# EAGLE design flowerfriend_rev4 (EAGLE 7.2.0)
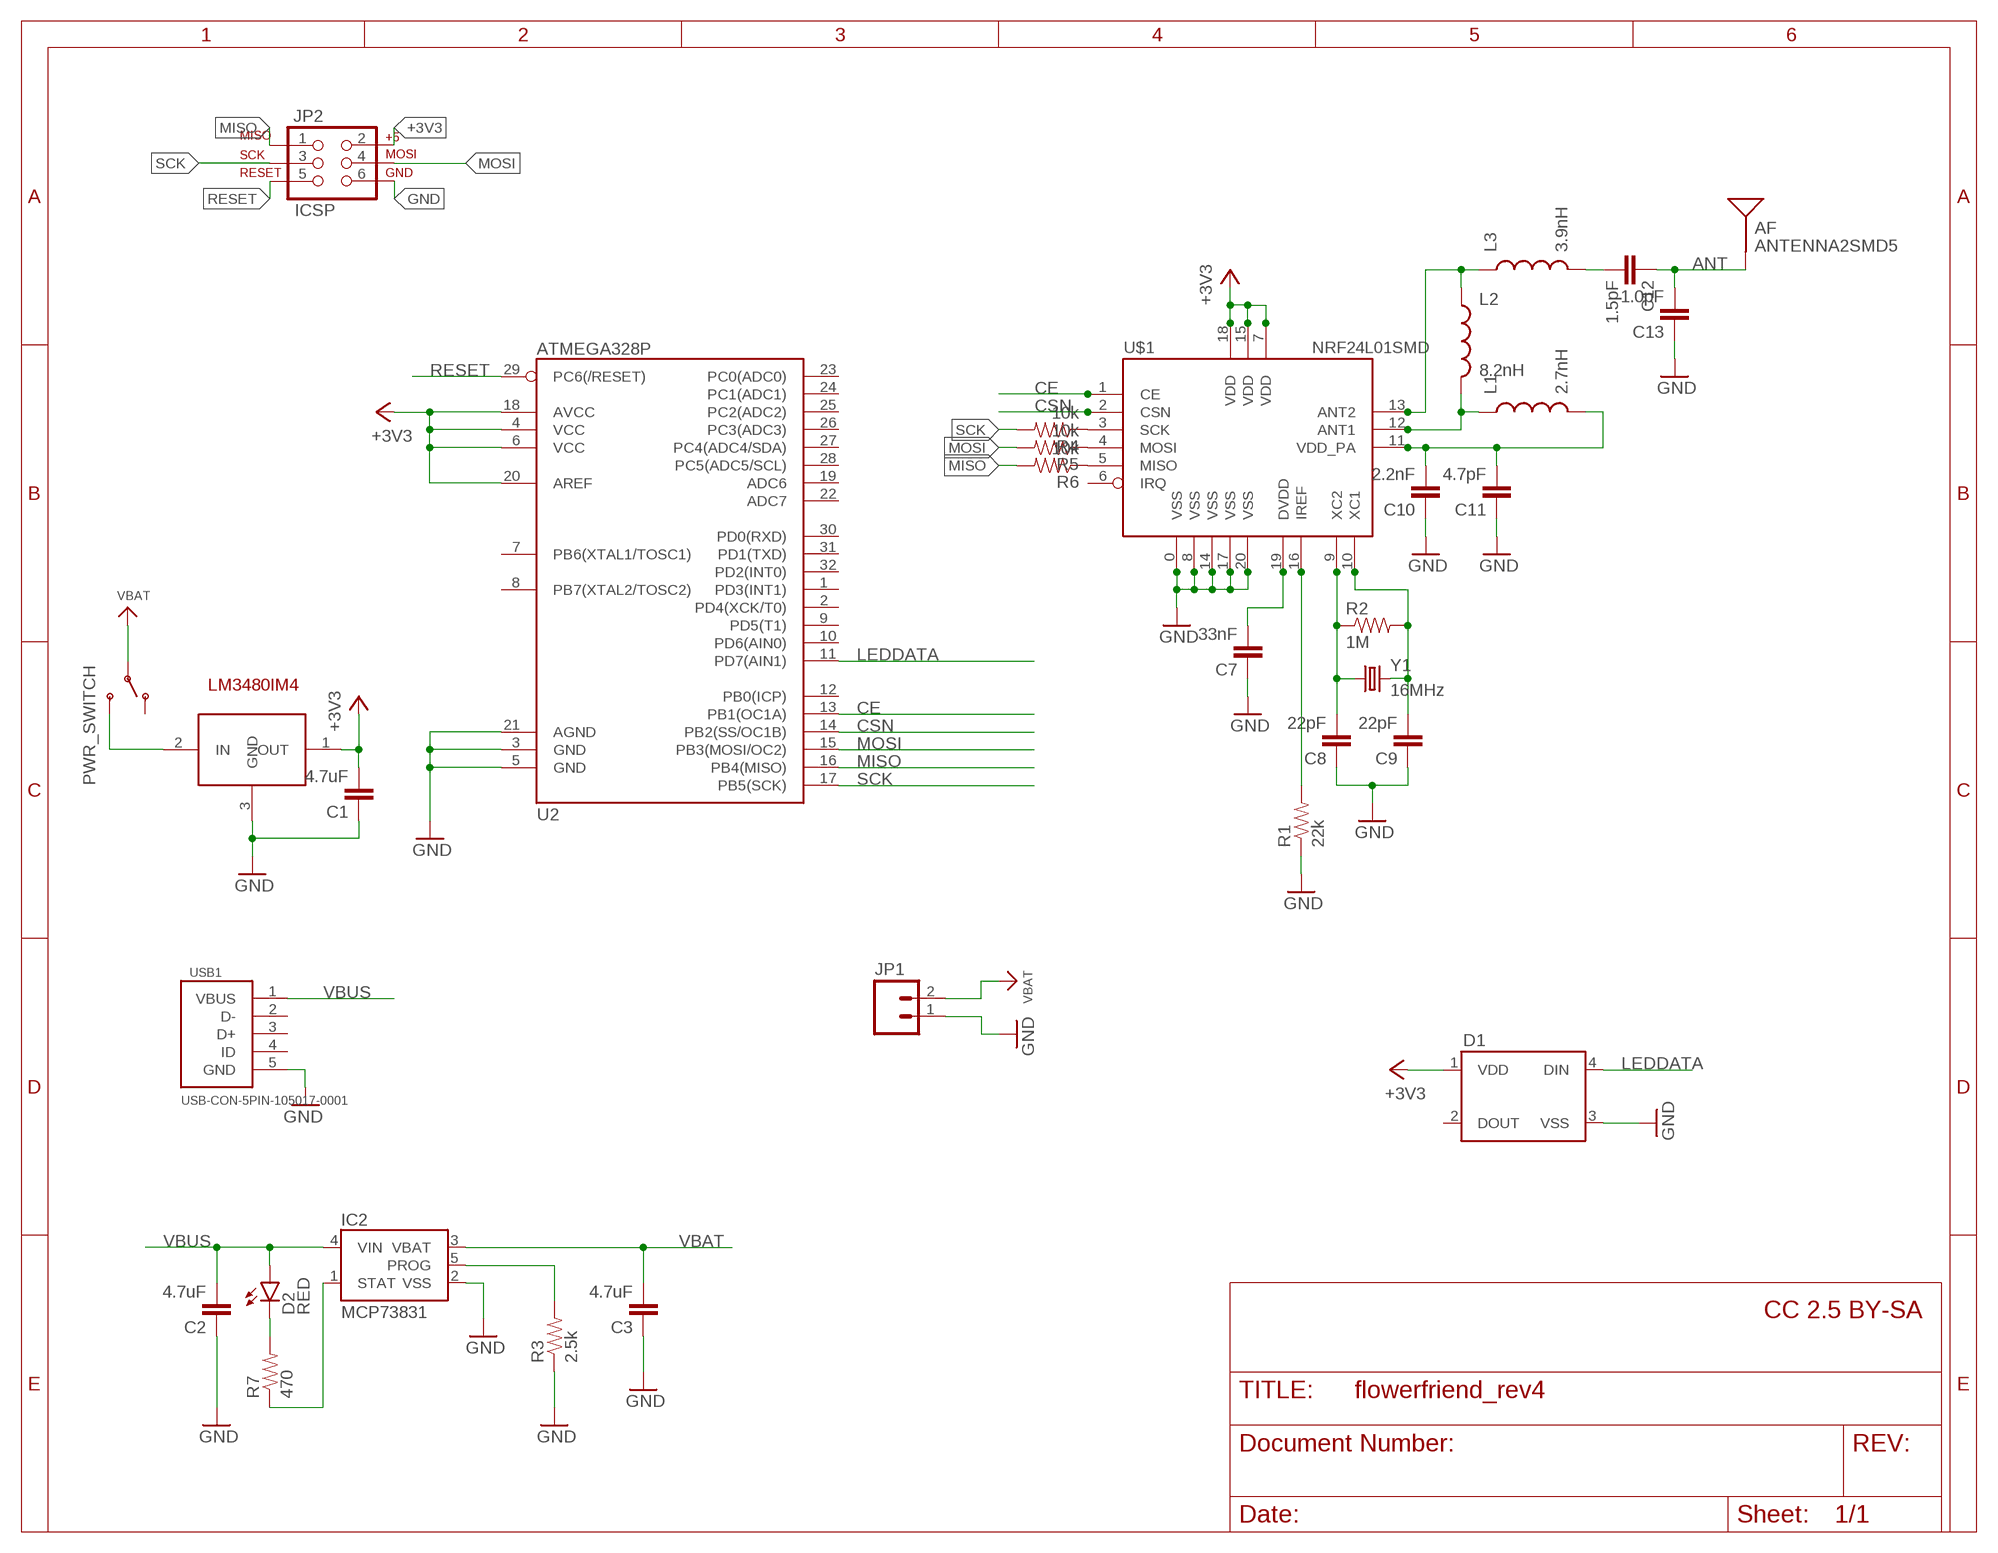
[diagram p0: schematic, sheet 1]

## Parts
AF  ANTENNA2SMD5  [ANTENNA-CHIP5]
C1  4.7uF  CAP0805  [0805]
C2  4.7uF  CAP0805  [0805]
C3  4.7uF  CAP0805  [0805]
C7  33nF  CAP0805  [0805]
C8  22pF  CAP0805  [0805]
C9  22pF  CAP0805  [0805]
C10  2.2nF  CAP0805  [0805]
C11  4.7pF  CAP0805  [0805]
C12  1.5pF  CAP0805  [0805]
C13  1.0pF  CAP0805  [0805]
D1  WS2812B  [WS2812B]
D2  RED  LED-RED0603  [LED-0603]
IC1  LM3480IM4  [SOT23-3]
IC2  MCP73831  [SOT23-5]
JP1  M02PTH  [1X02]
JP2  ICSP  AVR_SPI_PRG_6PTH  [2X3]
L1  2.7nH  INDUCTOR0805  [0805]
L2  8.2nH  INDUCTOR0805  [0805]
L3  3.9nH  INDUCTOR0805  [0805]
PWR_SWITCH  SWITCH_SPDT  [KPS-1290]
R1  22k  RESISTOR0805-RES  [0805]
R2  1M  RESISTOR0805-RES  [0805]
R3  2.5k  RESISTOR0805-RES  [0805]
R4  10k  RESISTOR0805-RES  [0805]
R5  10k  RESISTOR0805-RES  [0805]
R6  10k  RESISTOR0805-RES  [0805]
R7  470  RESISTOR0805-RES  [0805]
U2  ATMEGA328P  ATMEGA328_SMT  [TQFP32-08]
U$1  NRF24L01SMD  [QFN20]
USB1  USB-CON-5PIN-105017-0001  [USB-MICRO-MOLEX-105017-0001]
Y1  16MHz  CRYSTAL5X3  [CRYSTAL-SMD-5X3]

## Nets
+3V3 [power]: C1.2 D1.1(VDD) IC1.1(OUT) JP2.2 U2.4(VCC) U2.6(VCC) U2.18(AVCC) U2.20(AREF) U$1.7(VDD) U$1.15(VDD) U$1.18(VDD)
ANT: AF.FEED(SIGNAL) C12.1 C13.2
CE: U2.13(PB1(OC1A)) U$1.1(CE)
CSN: U2.14(PB2(SS/OC1B)) U$1.2(CSN)
GND [power]: C1.1 C2.1 C3.1 C7.1 C8.1 C9.1 C10.1 C11.1 C13.1 D1.3(VSS) IC1.3(GND) IC2.2(VSS) JP1.1 JP2.6 R1.1 R3.1 U2.3(GND) U2.5(GND) U2.21(AGND) U$1.0(VSS) U$1.8(VSS) U$1.14(VSS) U$1.17(VSS) U$1.20(VSS) USB1.5(GND)
LEDDATA: D1.4(DIN) U2.11(PD7(AIN1))
MISO: JP2.1 R6.2 U2.16(PB4(MISO))
MOSI: JP2.4 R5.2 U2.15(PB3(MOSI/OC2))
N$1: IC2.5(PROG) R3.2
N$4: C8.2 R2.1 U$1.9(XC2) Y1.1
N$5: C9.2 R2.2 U$1.10(XC1) Y1.3
N$6: R4.1 U$1.3(SCK)
N$7: R5.1 U$1.4(MOSI)
N$8: L2.1 L3.1 U$1.13(ANT2)
N$9: C10.2 C11.2 L1.2 U$1.11(VDD_PA)
N$10: R1.2 U$1.16(IREF)
N$11: C7.2 U$1.19(DVDD)
N$12: L1.1 L2.2 U$1.12(ANT1)
N$13: C12.2 L3.2
N$14: R6.1 U$1.5(MISO)
N$15 [power]: IC1.2(IN) PWR_SWITCH.S
N$16: D2.C R7.2
N$17: IC2.1(STAT) R7.1
RESET: JP2.5 U2.29(PC6(/RESET))
SCK: JP2.3 R4.2 U2.17(PB5(SCK))
VBAT [power]: C3.2 IC2.3(VBAT) JP1.2 PWR_SWITCH.P
VBUS: C2.2 D2.A IC2.4(VIN) USB1.1(VBUS)
Unconnected: D1.2(DOUT) PWR_SWITCH.O U2.1(PD3(INT1)) U2.2(PD4(XCK/T0)) U2.7(PB6(XTAL1/TOSC1)) U2.8(PB7(XTAL2/TOSC2)) U2.9(PD5(T1)) U2.10(PD6(AIN0)) U2.12(PB0(ICP)) U2.19(ADC6) U2.22(ADC7) U2.23(PC0(ADC0)) U2.24(PC1(ADC1)) U2.25(PC2(ADC2)) U2.26(PC3(ADC3)) U2.27(PC4(ADC4/SDA)) U2.28(PC5(ADC5/SCL)) U2.30(PD0(RXD)) U2.31(PD1(TXD)) U2.32(PD2(INT0)) U$1.6(IRQ) USB1.2(D-) USB1.3(D+) USB1.4(ID)

## Notes on the sheet
- CC 2.5 BY-SA

## Library data of the parts
AF = SparkFun-RF:ANTENNA2: Chip antenna Single endded antenna. Common with smaller chip antennas. CHIP4 package is the GPS Chip Antenna SKU: GPS-08418. CHIP5 package is 2.4GHz chip antenna SKU: WRL-00144.
C1-C3 C7-C13 = SparkFun-Passives:CAP: Capacitor Standard 0603 ceramic capacitor, and 0.1" leaded capacitor.
D1 = SparkFun-LED:WS2812B: WS2812B - Intelligent control LED integrated light source Technical Specifications: Power Supply Voltage (VDD): 3.5 to 5.3 V Input Voltage (VI): -0.5 to VDD+0.5 V Operating Junction Temperature (Topt): -25°C to +80°C Storage Temperature Range (Tstg): -55°C to +150°C; PROD_ID: DIO-12503
D2 = SparkFun-LED:LED-RED: Assorted Red LEDs LilyPad 1206- DIO-09912 1206- DIO-00809 0603- DIO-00819 "SMART" means more efficient and expensive; PROD_ID: DIO-00819
IC1 = SparkFun-PowerIC:LM3480IM4: Small package linear regulator
IC2 = SparkFun-PowerIC:MCP73831: Miniature single cell, fully integrated Li-Ion, Li-polymer charge management controller http://ww1.microchip.com/downloads/en/DeviceDoc/20001984g.pdf IC-09995; PROD_ID: IC-09995
JP1 = SparkFun-Connectors:M02: Standard 2-pin 0.1" header. Use with - straight break away headers ( PRT-00116) - right angle break away headers (PRT-00553) - swiss pins (PRT-00743) - machine pins (PRT-00117) - female headers (PRT-00115) Molex polarized connector foot print use with: PRT-08233 with associated crimp pins and housings. 2.54_SCREWTERM for use with PRT-10571. 3.5mm Screw Terminal footprints for PRT-08084 5mm Screw Terminal footprints for use with PRT-08432
JP2 = SparkFun-Connectors:AVR_SPI_PRG_6: AVR ISP 6 Pin This is the reduced ISP connector for AVR programming. Common on Arduino. This footprint will take up less PCB space and can be used with a 10-pin to 6-pin adapter such as SKU: BOB-08508 **Special note about "TEST_POINT" package. The stop mask is on the top side, so if you want your programming test points to be on the bottom of your board, make sure to place this package on the bottom side of the board. This also ensure that the orientation to program from the bottom side will be correct.
L1-L3 = SparkFun-Passives:INDUCTOR: Inductors Basic Inductor/Choke - 0603 and 1206. Footprints are not proven and vary greatly between part numbers. SRN6045- 33uH, 20% 1.4A SDR0403-560KL - 56uH, 10%, 500mA RMS/740mA peak
PWR_SWITCH = SparkFun-Electromechanical:SWITCH_SPDT: SWCH-10651 Side-actuated SPDT slide switch, as used on the Arduino Pro; PROD_ID: SWCH-10651
R1-R7 = SparkFun-Passives:RESISTOR: Resistor Basic schematic elements and footprints for 0603, 1206, and PTH resistors.
U2 = SparkFun-DigitalIC:ATMEGA328_SMT: 32-Pin Atmega328 part Commonly used on Arduino compatible boards Available in QFP and QFN packages TQFP is IC-09069 QFN is non-stock; PROD_ID: IC-09069
U$1 = SparkFun-RF:NRF24L01: 2.4GHz Low Power Transceiver This is the very popular, low cost, very low power RF transceiver from Nordic Semiconductor. Simple SPI interface. SKU: COM-00690
USB1 = GeekAmmo:USB-CON-5PIN: Molex Micro USB 105017-0001
Y1 = SparkFun-FreqCtrl:CRYSTAL: Various standard crystals. Proven footprints.; PROD_ID: XTAL-08218

## Net classes
1 power: width 0.305 mm

## Board
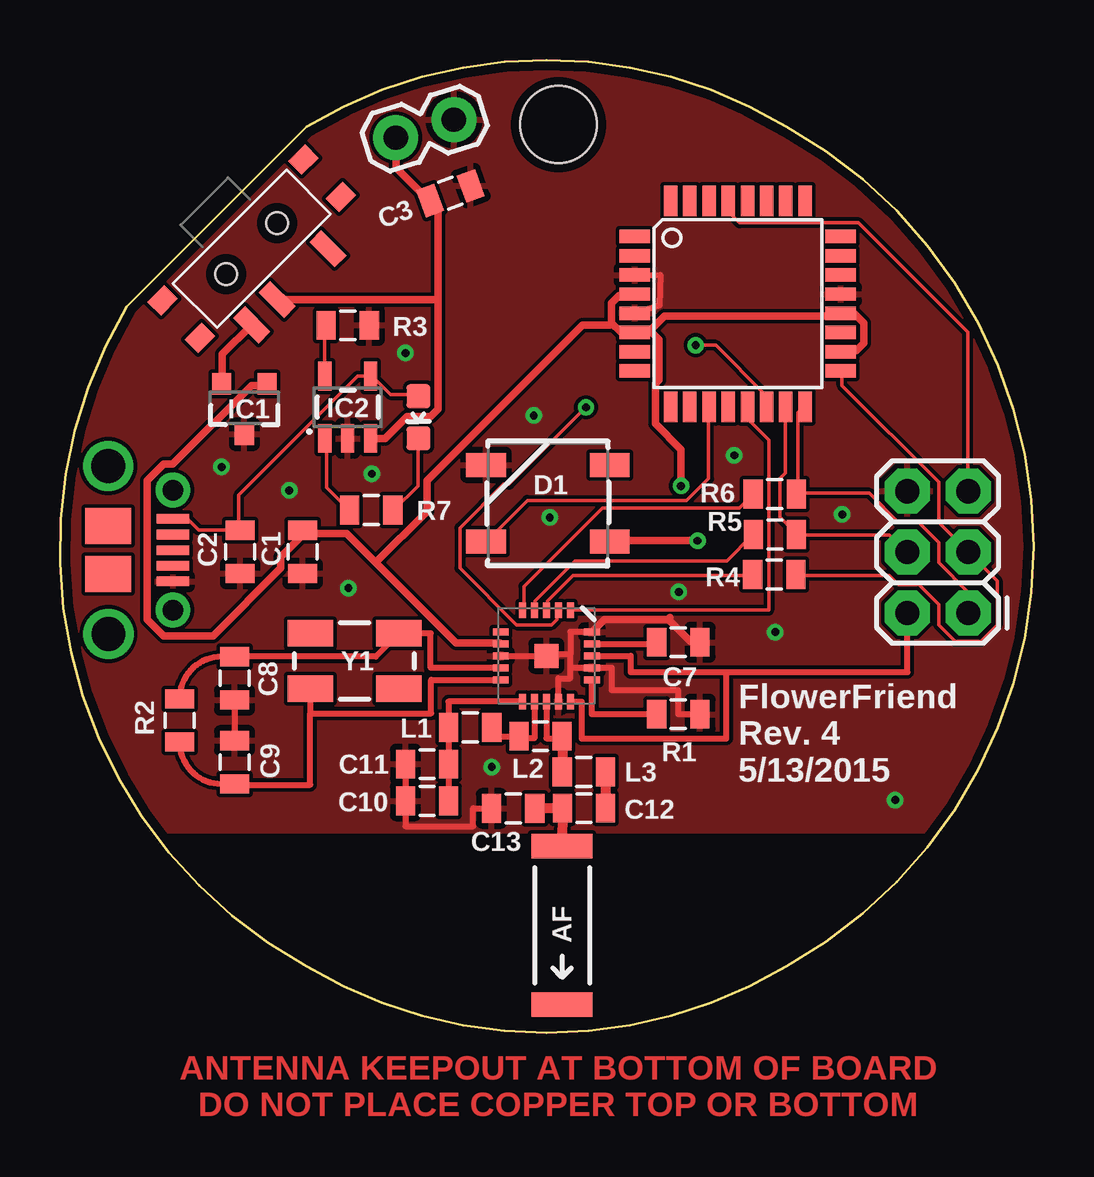
[diagram p1: board, top side]
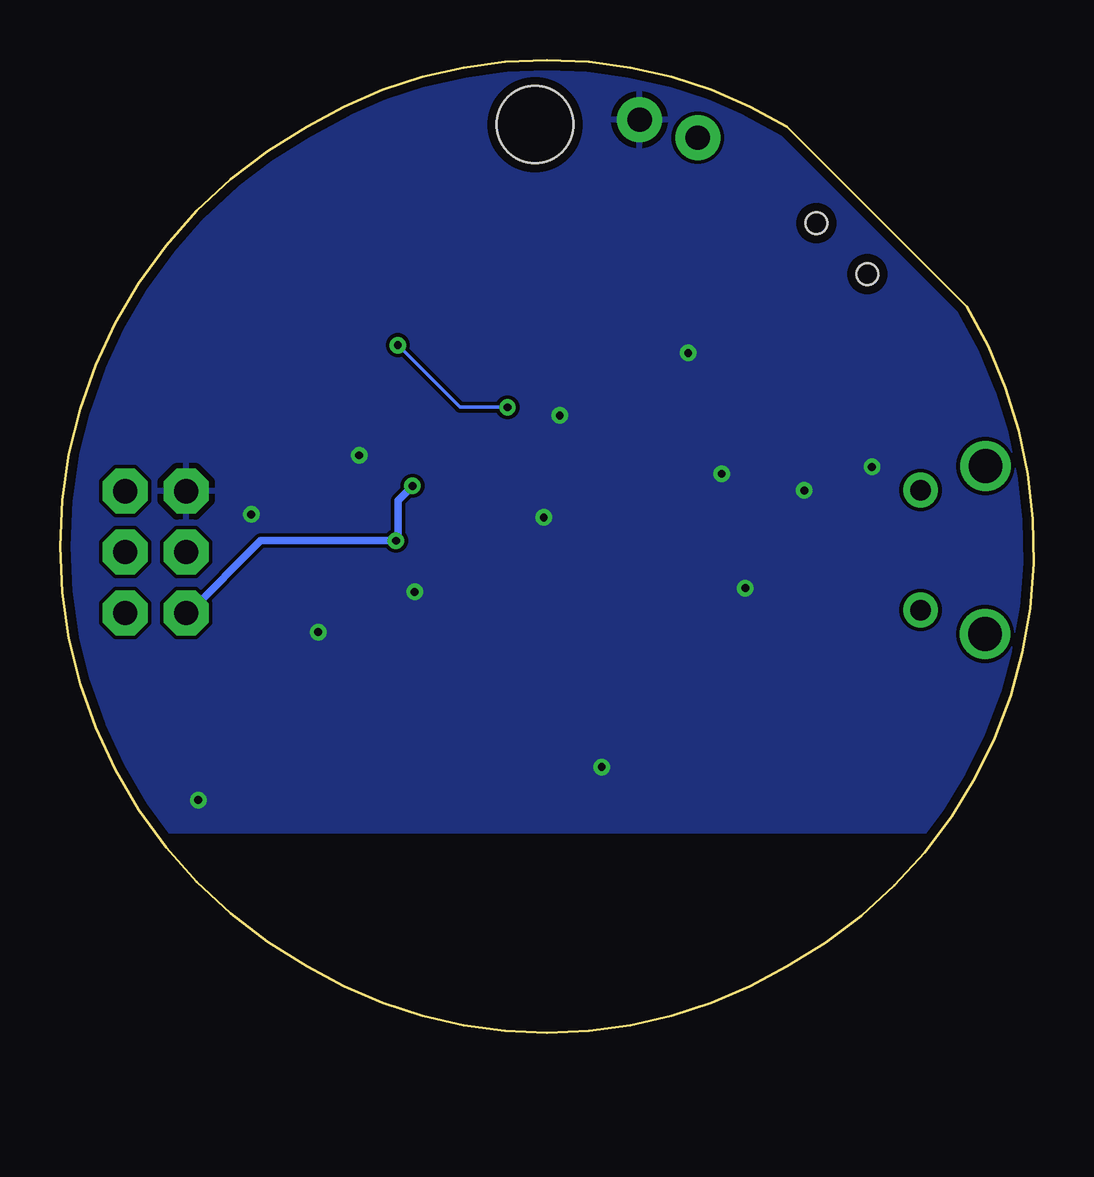
[diagram p2: board, bottom side, seen from below]

Size 40.58 x 40.55 mm. Coordinates in mm from the lower left corner, seen from the top.
Outline: 2.78,30.27 10.28,37.77 arc-62 30.28,37.77 arc-122 30.28,2.77 arc-62 10.28,2.77 arc-92 2.78,30.27
Copper layers (1*16): Top 0.0356mm / dielectric 1.5011mm / Bottom 0.0356mm
Design rules "LaenPCBOrder *": minimum track width 6mil, minimum drill 13mil, track to track 6mil, track to pad 6mil, pad to pad 6mil, via to via 6mil, smd to smd 6mil, copper to edge 15mil, drill to drill 6mil, minimum pad ring 7mil, minimum via ring 7mil, stop-mask expansion 3mil, vias tented up to drill 0mil, thermal gap 10mil
Holes 3.2 mm at 20.78,37.86
tKeepout: area -0.7,0.3 to 41.3,8.3
bKeepout: area -0.7,0.3 to 41.3,8.3

### Footprints (pad centres in the part's own frame; a part is rotated, then mirrored left to right if it is on the bottom)
ANTENNA-CHIP5 = smd 1.016 x 2.54: FEED -3.302,0; NC 3.302,0
0805 = smd 0.8 x 1.2: 1 -0.9,0; 2 0.9,0
WS2812B = smd 1.651 x 1: 1 -2.577,1.6; 2 -2.577,-1.6; 3 2.577,-1.6; 4 2.577,1.6
LED-0603 = smd 1 x 1: A 0,-0.877; C 0,0.877
SOT23-3 = smd 0.8 x 0.9: 1 -0.95,-1; 2 0.95,-1; 3 0,1.1
SOT23-5 = smd 0.55 x 1.2: 1 -0.95,-1.3; 2 0,-1.3; 3 0.95,-1.3; 4 0.95,1.3; 5 -0.95,1.3
1X02 = drill 1.016 pad 1.88: 1 0,0; 2 2.54,0
2X3 = drill 1.016 pad 1.88 octagon: 1 0,0; 2 0,2.54; 3 2.54,0; 4 2.54,2.54; 5 5.08,0; 6 5.08,2.54
KPS-1290 = smd 0.7 x 1.5: O -2.25,2.25; P 0.75,2.25; S 2.25,2.25 | smd 1 x 0.8: P$1 -4.15,1.1; P$2 -4.15,-1.1; P$3 4.15,-1.1; P$4 4.15,1.1 | hole 0.9: -1.5,0; 1.5,0
TQFP32-08 = smd 1.27 x 0.559: 1 -4.293,2.8; 2 -4.293,2; 3 -4.293,1.2; 4 -4.293,0.4; 5 -4.293,-0.4; 6 -4.293,-1.2; 7 -4.293,-2; 8 -4.293,-2.8; 17 4.293,-2.8; 18 4.293,-2; 19 4.293,-1.2; 20 4.293,-0.4; 21 4.293,0.4; 22 4.293,1.2; 23 4.293,2; 24 4.293,2.8 | smd 0.559 x 1.27: 9 -2.8,-4.293; 10 -2,-4.293; 11 -1.2,-4.293; 12 -0.4,-4.293; 13 0.4,-4.293; 14 1.2,-4.293; 15 2,-4.293; 16 2.8,-4.293; 25 2.8,4.293; 26 2,4.293; 27 1.2,4.293; 28 0.4,4.293; 29 -0.4,4.293; 30 -1.2,4.293; 31 -2,4.293; 32 -2.8,4.293
QFN20 = smd 1 x 1: 0 0,0 | smd 0.65 x 0.3: 1 -1.9,1; 2 -1.9,0.5; 3 -1.9,0; 4 -1.9,-0.5; 5 -1.9,-1; 11 1.9,-1; 12 1.9,-0.5; 13 1.9,0; 14 1.9,0.5; 15 1.9,1 | smd 0.3 x 0.65: 6 -1,-1.9; 7 -0.5,-1.9; 8 0,-1.9; 9 0.5,-1.9; 10 1,-1.9; 16 1,1.9; 17 0.5,1.9; 18 0,1.9; 19 -0.5,1.9; 20 -1,1.9
USB-MICRO-MOLEX-105017-0001 = smd 0.4 x 1.35: 1 1.2,0; 2 1.85,0; 3 2.5,0; 4 3.15,0; 5 3.8,0 | drill 0.85 pad 1.45: P$1 0,0; P$2 5,0 | smd 1.5 x 1.9: P$3 3.5,-2.7; P$4 1.5,-2.7 | drill 1.4: P$5 -1.004,-2.701; P$6 5.999,-2.69
CRYSTAL-SMD-5X3 = smd 1.9 x 1.1: 1 -1.85,-1.15; 2 1.85,-1.15; 3 1.85,1.15; 4 -1.85,1.15

### Placement (x,y rotation side)
AF  20.93,4.47 270 top
C1  10.11,20.04 90 top
C2  7.51,20.04 90 top
C3  16.28,34.99 200 top
C7  25.78,16.27 180 top
C8  7.28,14.77 90 top
C9  7.28,11.27 270 top
C10  15.3,9.66 0 top
C11  15.3,11.19 0 top
C12  21.84,9.36 0 top
C13  18.89,9.35 0 top
D1  20.34,22.07 180 top
D2  14.94,25.65 180 top
IC1  7.69,26.05 180 top
IC2  11.99,26.07 0 top
JP1  16.42,38.06 197.1 top
JP2  37.86,17.49 90 top
L1  17.1,12.72 180 top
L2  20.03,12.36 180 top
L3  21.84,10.87 0 top
PWR_SWITCH  7.99,32.68 225 top
R1  25.78,13.27 180 top
R2  4.98,13.02 270 top
R3  11.99,29.49 180 top
R4  29.77,19.09 0 top
R5  29.8,20.77 0 top
R6  29.79,22.45 0 top
R7  12.98,21.78 0 top
U2  28.26,30.39 0 top
U$1  20.28,15.7 270 top
USB1  4.71,22.62 270 top
Y1  12.28,15.49 180 top

### Tracks (layer width: path | path; a pad name or v marks a point on that pad's centre or on a via)
+3V3  (via drill 0.33)
  Top 0.254: U$1.18 23.78,15.7 23.78,15.03 27.77,15.03 | 27.77,15.03 35.32,15.03 JP2.2 | U$1.15 21.74,13.8 21.74,12.26 27.77,12.26 27.77,15.03
  Top 0.305: 18.35,16.24 U$1.7 18.19,16.24 16.52,16.24 13.16,19.59 | v26.58,20.51 22.92,20.51 D1.1 | U2.18 32.6,28.43 33.21,28.43 33.51,28.74 33.51,29.57 33.13,29.95 32.6,29.95 U2.20 32.44,29.88 25.2,29.88 24.59,29.27 | 22.99,29.57 23.38,29.19 23.91,29.19 U2.6 24.06,29.27 24.59,29.27 | 22.99,29.57 22.99,30.41 23.3,30.72 23.91,30.72 U2.4 | 13.16,19.59 11.95,20.81 10.19,20.81 10.12,20.89 C1.2 10.12,20.73 9.2,19.82 9.2,19.36 6.38,16.54 4.33,16.54 3.64,17.23 3.64,23.02 4.33,23.71 4.71,23.71 7.98,26.98 8.59,26.98 IC1.1 | 13.16,19.59 15.3,21.73 15.3,23.02 21.78,29.5 22.92,29.5 22.99,29.57 | v25.89,22.79 25.89,24.32 24.82,25.38 24.82,27.06 24.98,27.21 24.98,28.89 24.59,29.27
  Bottom 0.305: JP2.2 35.26,17.46 32.21,20.51 v26.58,20.51 26.5,20.58 26.5,22.18 v25.89,22.79
ANT
  Top 0.254: C13.2 | C12.1
  Top 0.406: C12.1 C13.2 | C12.1 AF.FEED
CE
  Top 0.152: 21.32,17.61 U$1.1 21.39,17.61 29.55,17.61 29.55,24.7 28.71,25.54 28.71,26.07 U2.13
CSN  (via drill 0.33)
  Top 0.152: U$1.2 20.71,17.53 20.71,17.23 20.48,17 19.03,17 16.67,19.36 16.67,21.04 18.5,22.87 18.73,22.87 v21.93,26.07 | v26.5,28.66 27.34,28.66 29.4,26.6 29.4,26.14 U2.14
  Bottom 0.152: v21.93,26.07 23.91,26.07 v26.5,28.66
GND  (via drill 0.33 pad 0.33)
  Top 0.254: U$1.17 21.28,15.2 | 21.28,15.2 21.28,15.77 | 21.28,15.77 20.28,15.77 U$1.0 U$1.8 | U$1.20 21.28,16.7 21.28,15.77 | U$1.14 20.78,14.77 21.28,14.77 21.28,15.2 | R1.1 25.78,13.27 25.78,14.27 23.01,14.27 23.01,15.2 U$1.17 | U$1.17 | C11.1 C10.1 | C10.1 | C10.1 14.4,8.61 17.22,8.61 17.22,9.35 C13.1 | C8.1 C9.1 | U2.3 25.02,31.59 24.99,30.31 U2.5
  Top 0.305: 25.36,17.23 26.27,16.32 26.65,16.32 C7.1 | 25.36,17.23 22.69,17.23 22.23,16.77 U$1.20 | 25.43,17.31 25.36,17.23
  other vias: 6.73,23.59 13,23.3 14.4,28.33 9.55,22.6 12.02,18.53 19.75,25.73 18,11.07 29.82,16.7 34.82,9.7 20.42,21.48 25.79,18.38 28.11,24.07 32.61,21.6
  pour Top: 41.28,8.36 -0.73,8.34 -0.72,41.27 41.28,41.27
  pour Bottom: 41.28,8.36 -0.73,8.34 -0.72,41.27 41.28,41.27
LEDDATA
  Top 0.152: U2.11 27.03,26.07 27.03,23.1 26.12,22.18 19.49,22.18 17.81,20.51 D1.4
MISO
  Top 0.152: 37.85,18.37 37.85,17.53 JP2.1 37.85,18.37 | U2.16 31,26.07 30.77,25.84 30.77,22.49 R6.2 30.84,22.49 33.74,22.49 34.96,21.27 35.8,21.27 36.63,20.43 36.63,19.59 37.85,18.37
MOSI
  Top 0.152: JP2.4 35.26,20.05 34.58,20.73 30.77,20.73 R5.2 30.69,20.81 30,21.5 30,23.1 30.23,23.33 30.23,26.07 U2.15
N$1
  Top 0.152: IC2.5 11.03,27.44 11.03,29.42 R3.2
N$4
  Top 0.254: U$1.9 | U$1.9 15.45,15.2 15.45,16.64 Y1.1 13.16,15.67 C8.2 6.74,15.67 arc90 R2.1
N$5
  Top 0.254: R2.2 arc90 6.73,10.37 C9.2 7.28,10.34 | 10.28,14.34 Y1.3 10.43,13.31 | 10.43,13.31 15.47,13.31 15.47,14.7 U$1.10 | 7.28,10.27 7.28,10.34 | 7.28,10.34 10.43,10.34 10.43,13.31
N$6
  Top 0.152: 20.33,17.61 U$1.3 20.33,17.69 20.33,17.99 21.39,19.06 28.86,19.06 R4.1
N$7
  Top 0.152: U$1.4 19.79,17.61 19.79,17.99 21.47,19.67 27.8,19.67 28.86,20.73 R5.1
N$8
  Top 0.254: U$1.13 20.28,12.27 21,12.27 L2.1
  Top 0.406: L2.1 L3.1
N$9
  Top 0.254: U$1.11 16.19,13.8 L1.2 C11.2 C10.2 | C10.2
N$10
  Top 0.254: R1.2 22.18,13.27 U$1.16
N$11
  Top 0.254: U$1.19 24.88,16.2 C7.2
N$12
  Top 0.254: U$1.12 19.78,12.27 19.13,12.27 L2.2 18,12.36 L1.1
N$13
  Top 0.254: L3.2
  Top 0.406: L3.2 C12.2
N$14
  Top 0.152: 19.34,17.61 U$1.5 19.34,17.69 19.34,18.6 22.61,21.88 28.33,21.88 28.86,22.41 R6.1
N$15
  Top 0.305: IC1.2 6.76,27.06 6.76,28.28 7.98,29.5 PWR_SWITCH.S
N$16
  Top 0.152: D2.C 14.92,24.77 14.92,22.79 13.93,21.8 R7.2
N$17
  Top 0.152: IC2.1 11.11,24.7 11.11,22.72 12.02,21.8 R7.1
RESET
  Top 0.152: U2.29 27.87,34.68 27.87,34.22 28.33,33.76 33.28,33.76 37.85,29.19 37.85,22.64 JP2.5
SCK
  Top 0.152: R4.2 30.69,19.06 34.58,19.06 34.96,18.68 35.8,18.68 36.63,17.84 36.63,17 37.32,16.32 38.39,16.32 39.07,17 39.07,18.83 37.93,19.97 JP2.3 37.85,20.05 36.63,21.27 36.63,22.94 32.6,26.98 32.6,27.52 U2.17
VBAT
  Top 0.305: 15.76,30.56 15.76,34.37 15.45,34.68 C3.2 15.3,34.76 14,36.05 14,37.27 JP1.2 | 15.76,30.56 15.76,25.99 15.45,25.69 14.46,25.69 13.55,24.77 13.01,24.77 IC2.3 | 15.76,30.56 9.13,30.56 PWR_SWITCH.P
VBUS
  Top 0.152: D2.A 14.92,26.6 13.77,26.6 13.01,27.36 IC2.4 12.4,27.36 7.45,22.41 7.45,21.04 C2.2 7.45,20.96 5.77,20.96 5.39,21.34 4.78,21.34 USB1.1

### Text on the board
Top: ANTENNA KEEPOUT AT BOTTOM OF BOARD / DO NOT PLACE COPPER TOP OR BOTTOM
tPlace: Y1 | FlowerFriend / Rev. 4 / 5/13/2015